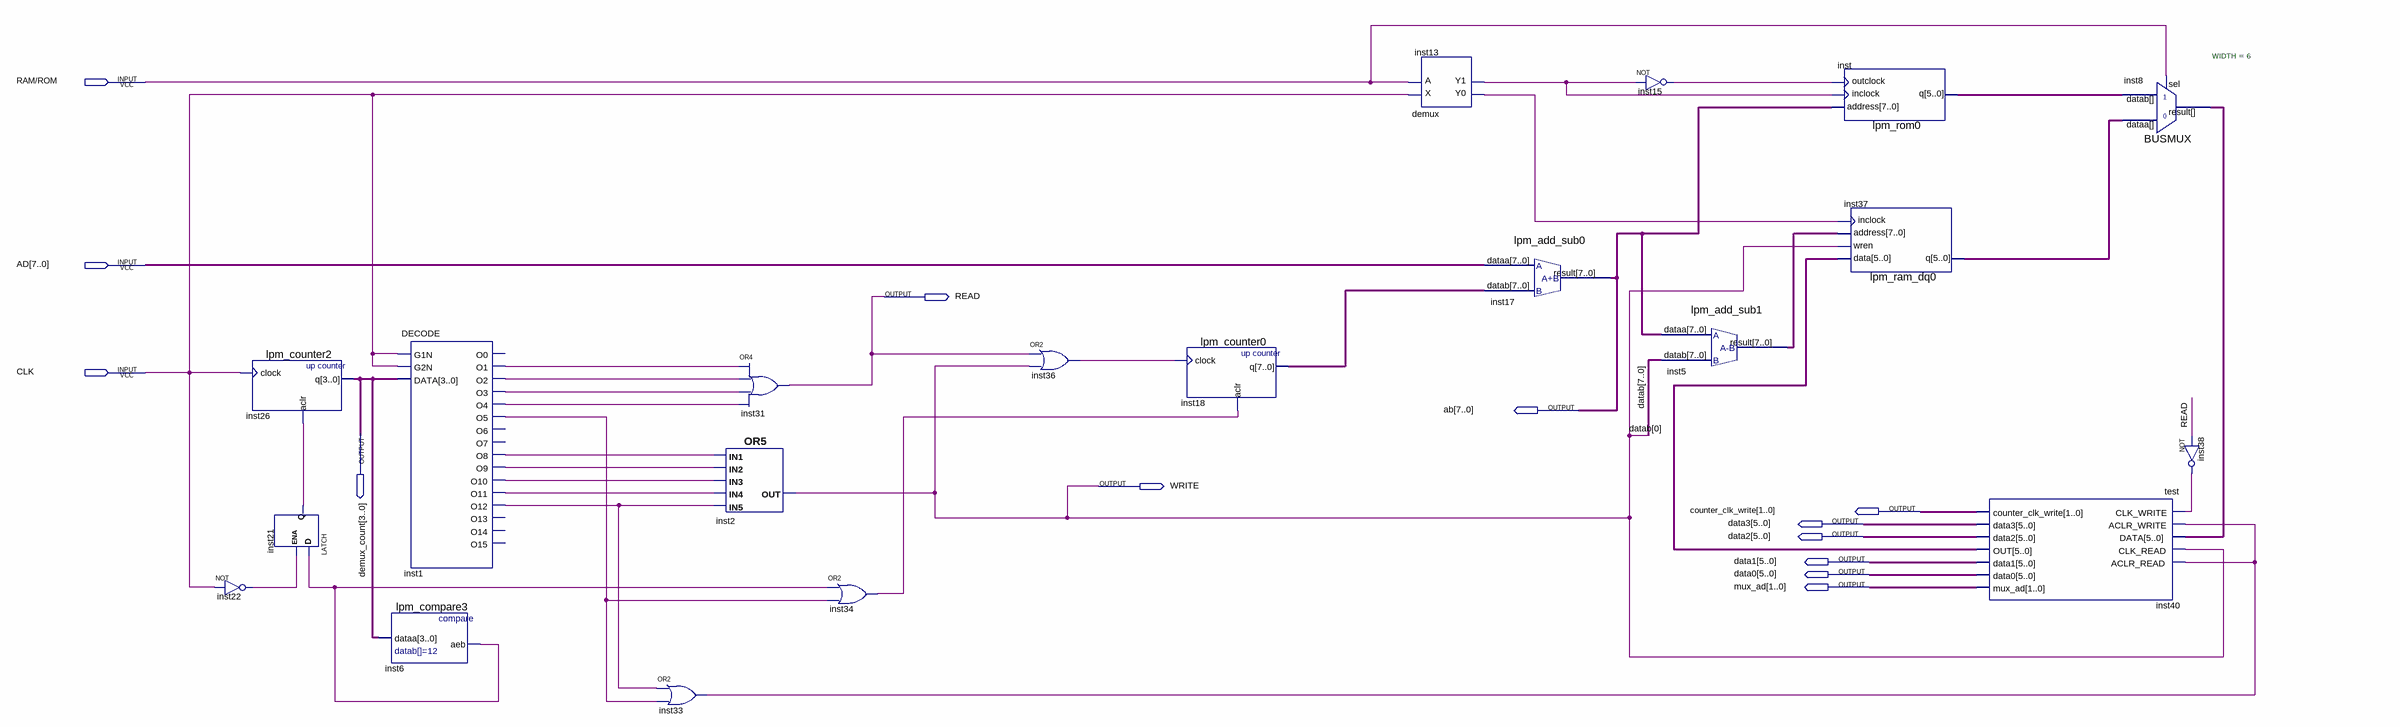
[diagram p0: schematic sheet]
// Quartus schematic MAIN.bdf as structural Verilog: 20 symbols, 13 pins
module MAIN (
  input  \RAM/ROM ,
  input  [7:0] AD,
  input  CLK,
  output READ,
  output [7:0] ab,
  output [3:0] demux_count,
  output WRITE,
  output [1:0] counter_clk_write,
  output [5:0] data3,
  output [5:0] data2,
  output [5:0] data1,
  output [5:0] data0,
  output [1:0] mux_ad
);

  wire inst1_o1, inst1_o2, inst1_o3, inst1_o4, inst1_o5, inst1_o8, inst1_o9, inst1_o10, inst1_o11, inst1_o12,
       inst6_aeb, inst13_y0, inst13_y1, inst15_out, inst21_q, inst22_out, inst33_out, inst34_out, inst36_out,
       inst38_out;
  wire [5:0] inst8_result, inst37_q, inst40_out, inst_q;
  wire [7:0] inst5_result, inst18_q;
  wire [7:1] datab;

  not inst22 (inst22_out, CLK);
  lpm_counter2 inst26 (.clock(CLK), .aclr(inst21_q), .q(demux_count));
  LATCH inst21 (.D(inst6_aeb), .ENA(inst22_out), .Q(inst21_q));
  lpm_compare3 inst6 (.dataa(demux_count), .aeb(inst6_aeb));
  DECODE inst1 (
    .G1N(CLK), .G2N(CLK), .DATA(demux_count), .O1(inst1_o1), .O2(inst1_o2), .O3(inst1_o3), .O4(inst1_o4),
    .O5(inst1_o5), .O8(inst1_o8), .O9(inst1_o9), .O10(inst1_o10), .O11(inst1_o11), .O12(inst1_o12));  // open: O0, O6, O7, O13, O14, O15
  or inst33 (inst33_out, inst1_o12, inst1_o5);
  or inst2 (WRITE, inst1_o8, inst1_o9, inst1_o10, inst1_o11, inst1_o12);
  or inst31 (READ, inst1_o1, inst1_o2, inst1_o3, inst1_o4);
  or inst34 (inst34_out, inst6_aeb, inst1_o5);
  or inst36 (inst36_out, READ, WRITE);
  lpm_counter0 inst18 (.clock(inst36_out), .aclr(inst34_out), .q(inst18_q));
  demux inst13 (.X(CLK), .A(\RAM/ROM ), .Y0(inst13_y0), .Y1(inst13_y1));
  lpm_add_sub0 inst17 (.dataa(AD), .datab(inst18_q), .result(ab));
  not inst15 (inst15_out, inst13_y1);
  lpm_add_sub1 inst5 (.dataa(ab), .datab({datab, WRITE}), .result(inst5_result));
  lpm_rom0 inst (.address(ab), .inclock(inst13_y1), .outclock(inst15_out), .q(inst_q));
  lpm_ram_dq0 inst37 (.data(inst40_out), .wren(WRITE), .address(inst5_result), .inclock(inst13_y0), .q(inst37_q));
  test inst40 (
    .CLK_WRITE(inst38_out), .ACLR_WRITE(inst33_out), .DATA(inst8_result), .CLK_READ(WRITE),
    .ACLR_READ(inst33_out), .counter_clk_write(counter_clk_write), .data3(data3), .data2(data2),
    .OUT(inst40_out), .data1(data1), .data0(data0), .mux_ad(mux_ad));
  BUSMUX #(.WIDTH(6)) inst8 (.datab(inst_q), .sel(\RAM/ROM ), .dataa(inst37_q), .result(inst8_result));
  not inst38 (inst38_out, READ);

  // Other names for the same wires on the sheet: datab[0] = WRITE
endmodule
